# EAGLE design zero_board (EAGLE 6.6.0)
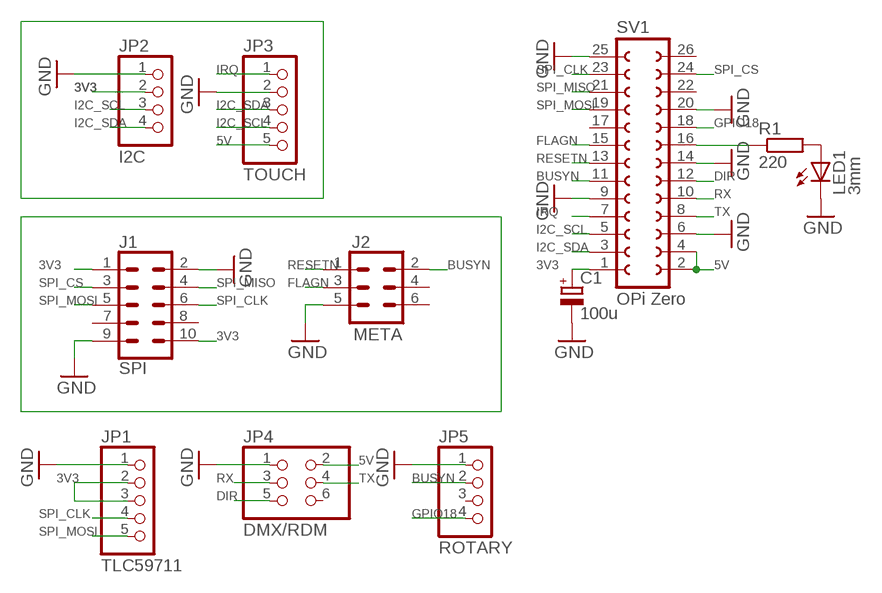
[diagram p0: schematic, sheet 1]

## Parts
C1  100u  CPOL-EUE2.5-6  [E2,5-6]
J1  SPI  CONN_05X2SHD  [2X5-SHROUDED]
J2  META  CONN_03X2SHROUD  [2X3-SHROUDED]
JP1  TLC59711  PINHD-1X5  [1X05]
JP2  I2C  PINHD-1X4  [1X04]
JP3  TOUCH  PINHD-1X5  [1X05]
JP4  DMX/RDM  PINHD-2X3  [2X03]
JP5  ROTARY  PINHD-1X4  [1X04]
LED1  3mm  LED3MM  [LED3MM]
R1  220  R-EU_0204/2V  [0204V]
SV1  OPi Zero  FE13-2  [FE13-2]

## Nets
3V3: C1.+ J1.1 J1.10 JP1.2 JP1.3 JP2.2 SV1.1
5V: JP3.5 JP4.2 SV1.2 SV1.4
BUSYN: J2.2 JP5.2 SV1.11
DIR: JP4.5 SV1.12
FLAGN: J2.3 SV1.15
GND: C1.- J1.2 J1.9 J2.5 JP1.1 JP2.1 JP3.2 JP4.1 JP5.1 LED1.K(C) SV1.6 SV1.9 SV1.14 SV1.20 SV1.25
GPIO18: JP5.4 SV1.18
I2C_SCL: JP2.3 JP3.4 SV1.5
I2C_SDA: JP2.4 JP3.3 SV1.3
IRQ: JP3.1 SV1.7
N$3: LED1.A R1.2
N$4: R1.1 SV1.16
RESETN: J2.1 SV1.13
RX: JP4.3 SV1.10
SPI_CLK: J1.6 JP1.4 SV1.23
SPI_CS: J1.3 SV1.24
SPI_MISO: J1.4 SV1.21
SPI_MOSI: J1.5 JP1.5 SV1.19
TX: JP4.4 SV1.8
Unconnected: J1.7 J1.8 J2.4 J2.6 JP4.6 JP5.3 SV1.17 SV1.22 SV1.26

## Library data of the parts
C1 = rcl:CPOL-EU: POLARIZED CAPACITOR, European symbol
J1 = SparkFun-Connectors:CONN_05X2: Multi connection point. Often used as Generic Header-pin footprint for 0.1 inch spaced/style header connections For AVR SPI programming port, see special device with nice symbol: "AVR_SPI_PROG_5x2.dev" You can populate with any combo of single row headers, but if you'd like an exact match, check these: 2x5 AVR ICSP Male Header <https://www.sparkfun.com/products/778> (PRT-00778) 2x5 Pin Shrouded Header <https://www.sparkfun.com/products/8506> (PRT-08506) On any of the 0.1 inch spaced packages, you can populate with these: Break Away Headers - Straight <https://www.sparkfun.com/products/116> (PRT-00116) Break Away Male Headers - Right Angle <https://www.sparkfun.com/products/553> (PRT-00553) Female Headers <https://www.sparkfun.com/products/115> (PRT-00115) Break Away Headers - Machine Pin <https://www.sparkfun.com/products/117> (PRT-00117) Break Away Female Headers - Swiss Machine Pin <https://www.sparkfun.com/products/743> (PRT-00743) Special note: the shrouded connector mates well with our 5x2 ribbon cables: 2x5 Pin IDC Ribbon Cable <https://www.sparkfun.com/products/8535> (PRT-08535); PROD_ID: CONN-08671; SF_ID: PRT-08506
J2 = SparkFun-Connectors:CONN_03X2: Multi connection point. Often used as Generic Header-pin footprint for 0.1 inch spaced/style header connections You can populate with any combo of single row headers, but if you'd like an exact match, check these: Header - 2x3 (Male, 0.1") <https://www.sparkfun.com/products/12807> (PRT-12807) Header - 2x3 (Female, 0.1") <https://www.sparkfun.com/products/13010> (PRT-13010) 2x3 Pin Shrouded Header <https://www.sparkfun.com/products/10877> (PRT-10877) On any of the 0.1 inch spaced packages, you can populate with these: Break Away Headers - Straight <https://www.sparkfun.com/products/116> (PRT-00116) Break Away Male Headers - Right Angle <https://www.sparkfun.com/products/553> (PRT-00553) Female Headers <https://www.sparkfun.com/products/115> (PRT-00115) Break Away Headers - Machine Pin <https://www.sparkfun.com/products/117> (PRT-00117) Break Away Female Headers - Swiss Machine Pin <https://www.sparkfun.com/products/743> (PRT-00743) Special note: the shrouded connector mates well with our 3x2 ribbon cables: Ribbon Crimp Connector - 6-pin (2x3, Female) <https://www.sparkfun.com/products/10651> (PRT-10651) Ribbon Cable - 6 wire (15ft) <https://www.sparkfun.com/products/10646> (PRT-10646); PROD_ID: CONN-10681; SF_ID: PRT_10877
JP1 JP3 = pinhead:PINHD-1X5: PIN HEADER
JP2 JP5 = pinhead:PINHD-1X4: PIN HEADER
JP4 = pinhead:PINHD-2X3: PIN HEADER
LED1 = led:LED: LED OSRAM: - CHIPLED LG R971, LG N971, LY N971, LG Q971, LY Q971, LO R971, LY R971 LH N974, LH R974 LS Q976, LO Q976, LY Q976 LO Q996 - Hyper CHIPLED LW Q18S LB Q993, LB Q99A, LB R99A - SideLED LS A670, LO A670, LY A670, LG A670, LP A670 LB A673, LV A673, LT A673, LW A673 LH A674 LY A675 LS A676, LA A676, LO A676, LY A676, LW A676 LS A679, LY A679, LG A679 - Hyper Micro SIDELED® LS Y876, LA Y876, LO Y876, LY Y876 LT Y87S - SmartLED LW L88C, LW L88S LB L89C, LB L89S, LG L890 LS L89K, LO L89K, LY L89K LS L896, LA L896, LO L896, LY L896 - TOPLED LS T670, LO T670, LY T670, LG T670, LP T670 LSG T670, LSP T670, LSY T670, LOP T670, LYG T670 LG T671, LOG T671, LSG T671 LB T673, LV T673, LT T673, LW T673 LH T674 LS T676, LA T676, LO T676, LY T676, LB T676, LH T676, LSB T676, LW T676 LB T67C, LV T67C, LT T67C, LS T67K, LO T67K, LY T67K, LW E67C LS E67B, LA E67B, LO E67B, LY E67B, LB E67C, LV E67C, LT E67C LW T67C LS T679, LY T679, LG T679 LS T770, LO T770, LY T770, LG T770, LP T770 LB T773, LV T773, LT T773, LW T773 LH T774 LS E675, LA E675, LY E675, LS T675 LS T776, LA T776, LO T776, LY T776, LB T776 LHGB T686 LT T68C, LB T68C - Hyper Mini TOPLED® LB M676 - Mini TOPLED Santana® LG M470 LS M47K, LO M47K, LY M47K Source: http://www.osram.convergy.de LUXEON: - LUMILED® LXK2-PW12-R00, LXK2-PW12-S00, LXK2-PW14-U00, LXK2-PW14-V00 LXK2-PM12-R00, LXK2-PM12-S00, LXK2-PM14-U00 LXK2-PE12-Q00, LXK2-PE12-R00, LXK2-PE12-S00, LXK2-PE14-T00, LXK2-PE14-U00 LXK2-PB12-K00, LXK2-PB12-L00, LXK2-PB12-M00, LXK2-PB14-N00, LXK2-PB14-P00, LXK2-PB14-Q00 LXK2-PR12-L00, LXK2-PR12-M00, LXK2-PR14-Q00, LXK2-PR14-R00 LXK2-PD12-Q00, LXK2-PD12-R00, LXK2-PD12-S00 LXK2-PH12-R00, LXK2-PH12-S00 LXK2-PL12-P00, LXK2-PL12-Q00, LXK2-PL12-R00 Source: www.luxeon.com KINGBRIGHT: KA-3528ASYC Source: www.kingbright.com
R1 = resistor:R-EU_: RESISTOR, European symbol
SV1 = con-lsta:FE13-2: FEMALE HEADER; OC_FARNELL: unknown; OC_NEWARK: unknown

## Board
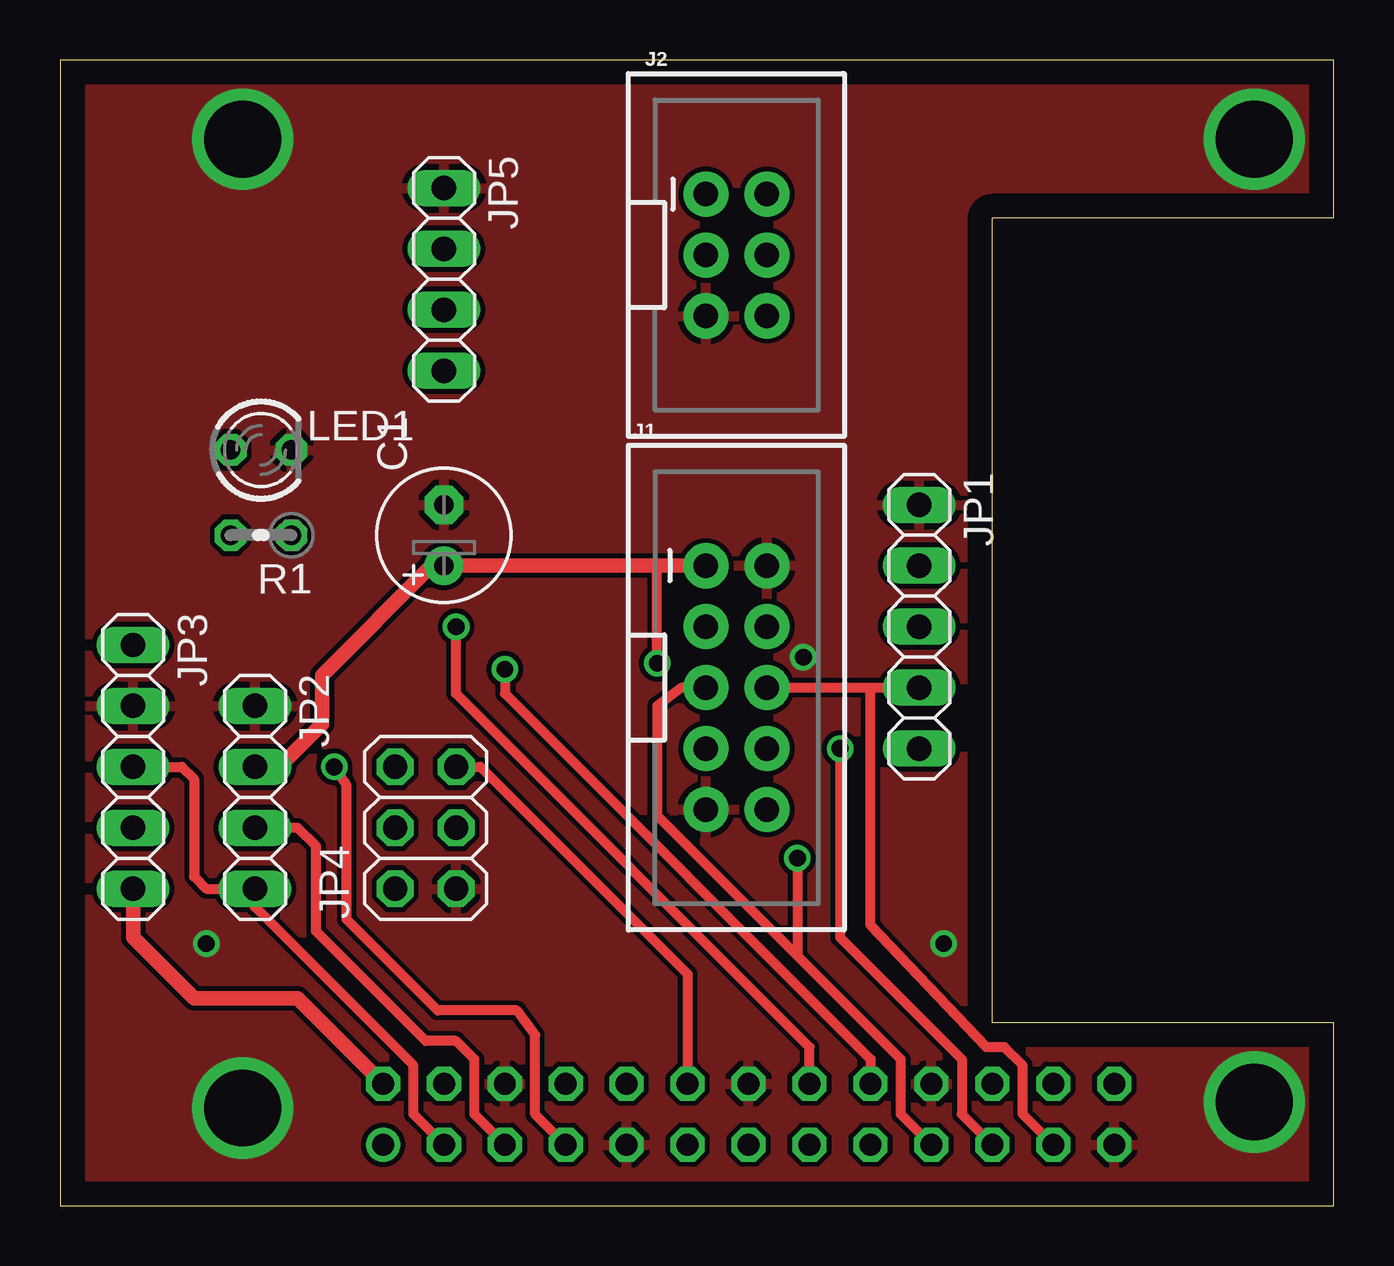
[diagram p1: board, top side]
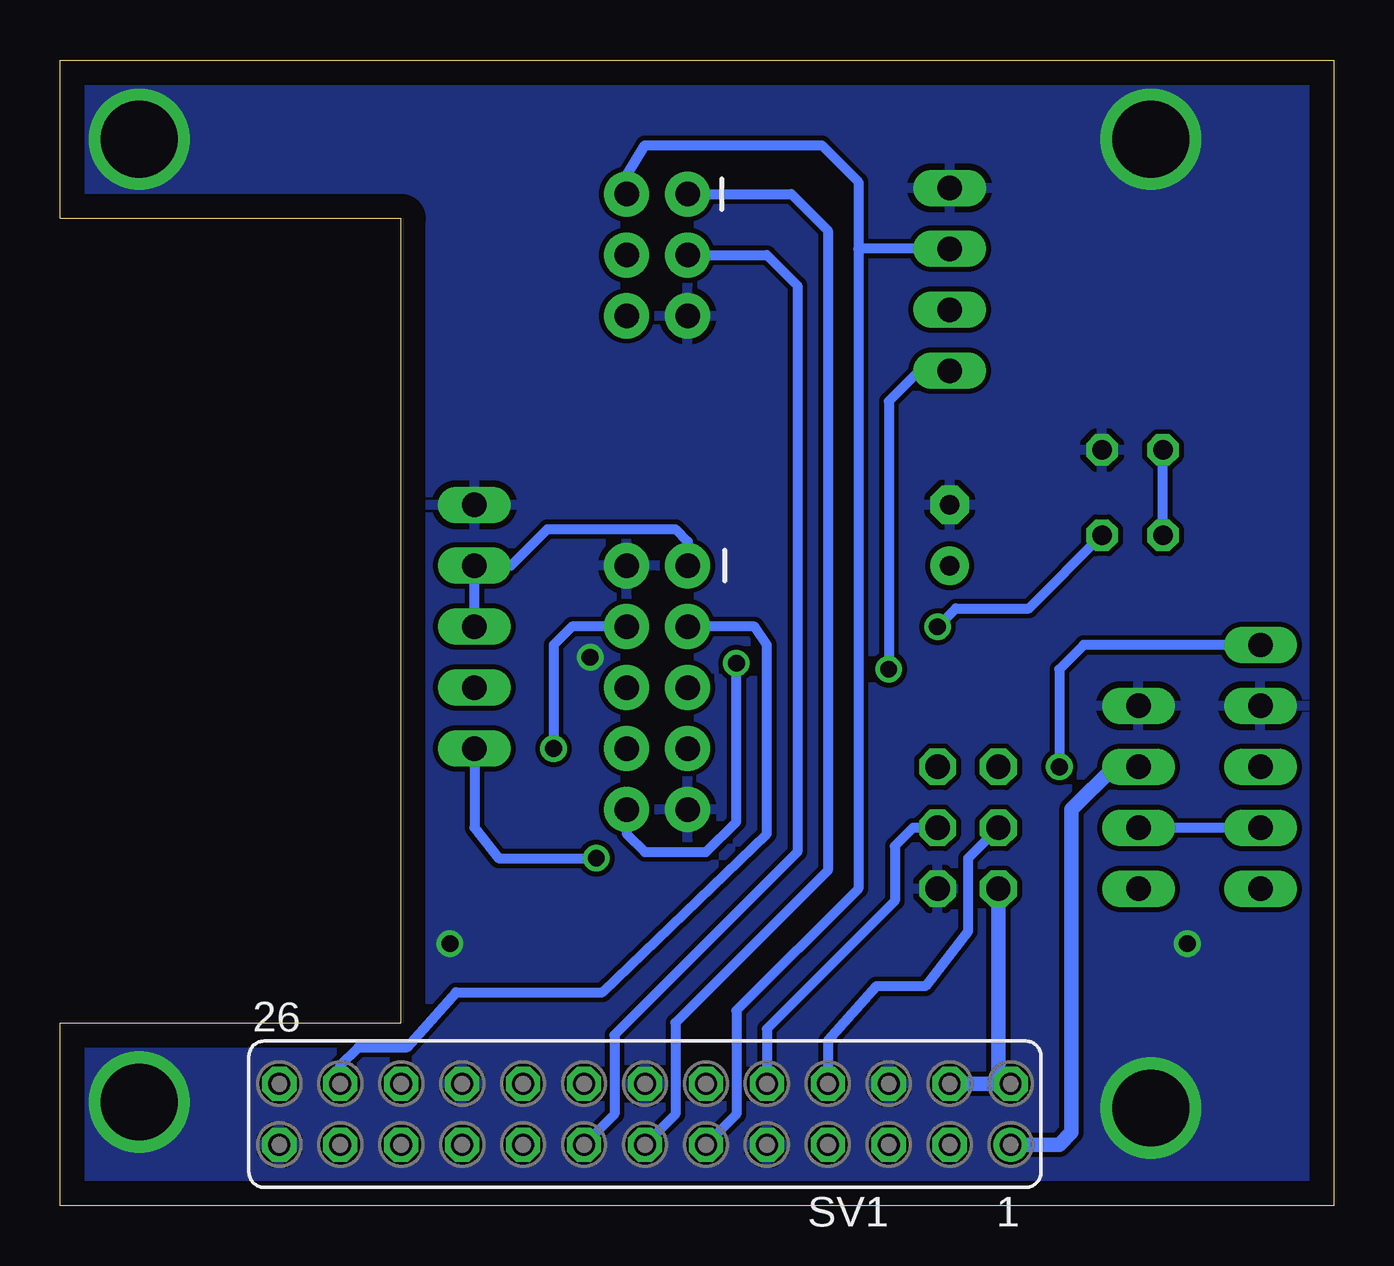
[diagram p2: board, bottom side, seen from below]

Size 53.09 x 47.75 mm. Coordinates in mm from the lower left corner, seen from the top.
Outline: 0,0 53.09,0 53.09,7.62 38.86,7.62 38.86,41.15 53.09,41.15 53.09,47.75 0,47.75 0,0
Copper layers (1*16): Top 0.035mm / dielectric 1.5mm / Bottom 0.035mm
Design rules "default": minimum track width 10mil, minimum drill 24mil, track to track 8mil, track to pad 8mil, pad to pad 8mil, via to via 8mil, smd to smd 8mil, copper to edge 40mil, drill to drill 8mil, minimum pad ring 10mil, minimum via ring 8mil, stop-mask expansion 4mil, vias tented up to drill 0mil, thermal gap 10mil

### Footprints (pad centres in the part's own frame; a part is rotated, then mirrored left to right if it is on the bottom)
E2,5-6 = drill 0.813 pad 1.6: + -1.27,0 | drill 0.813 pad 1.6 octagon: - 1.27,0
2X5-SHROUDED = drill 1.016 pad 1.88: 1 -1.27,5.08; 2 1.27,5.08; 3 -1.27,2.54; 4 1.27,2.54; 5 -1.27,0; 6 1.27,0; 7 -1.27,-2.54; 8 1.27,-2.54; 9 -1.27,-5.08; 10 1.27,-5.08
2X3-SHROUDED = drill 1.016 pad 1.88: 1 -1.27,2.54; 2 1.27,2.54; 3 -1.27,0; 4 1.27,0; 5 -1.27,-2.54; 6 1.27,-2.54
1X05 = drill 1.016 long: 1 -5.08,0; 2 -2.54,0; 3 0,0; 4 2.54,0; 5 5.08,0
1X04 = drill 1.016 long: 1 -3.81,0; 2 -1.27,0; 3 1.27,0; 4 3.81,0
2X03 = drill 1.016 octagon: 1 -2.54,-1.27; 2 -2.54,1.27; 3 0,-1.27; 4 0,1.27; 5 2.54,-1.27; 6 2.54,1.27
LED3MM = drill 0.813 octagon: A -1.27,0; K 1.27,0
0204V = drill 0.813 octagon: 1 -1.27,0; 2 1.27,0
FE13-2 = drill 0.914: 1 -15.24,1.27 | drill 0.914 octagon: 2 -15.24,-1.27; 3 -12.7,1.27; 4 -12.7,-1.27; 5 -10.16,1.27; 6 -10.16,-1.27; 7 -7.62,1.27; 8 -7.62,-1.27; 9 -5.08,1.27; 10 -5.08,-1.27; 11 -2.54,1.27; 12 -2.54,-1.27; 13 0,1.27; 14 0,-1.27; 15 2.54,1.27; 16 2.54,-1.27; 17 5.08,1.27; 18 5.08,-1.27; 19 7.62,1.27; 20 7.62,-1.27; 21 10.16,1.27; 22 10.16,-1.27; 23 12.7,1.27; 24 12.7,-1.27; 25 15.24,1.27; 26 15.24,-1.27

### Placement (x,y rotation side)
C1  16,27.94 90 top
J1  28.19,21.59 0 top
J2  28.19,39.62 0 top
JP1  35.81,24.13 270 top
JP2  8.13,17.02 270 top
JP3  3.05,18.29 270 top
JP4  15.24,15.75 90 top
JP5  16,38.61 270 top
LED1  8.38,31.5 0 top
R1  8.38,27.94 180 top
SV1  28.7,3.81 180 bottom

### Tracks (layer width: path | path; a pad name or v marks a point on that pad's centre or on a via)
3V3  (via drill 0.7)
  Top 0.406: v24.89,22.61 24.89,26.67
  Top 0.61: J1.1 24.89,26.67 C1.+ 15.49,26.67 10.92,22.1 10.92,20.07 9.14,18.29 JP2.2
  Bottom 0.406: JP2.2 9.14,18.29 | J1.10 29.46,15.49 28.7,14.73 26.16,14.73 24.89,16 v24.89,22.61 | JP1.3 JP1.2 34.29,26.67 32.77,28.19 27.43,28.19 26.92,27.69 J1.1
  Bottom 0.61: 9.14,18.29 10.92,16.51 10.92,3.05 11.43,2.54 SV1.1
5V
  Top 0.61: SV1.2 9.91,8.64 5.59,8.64 3.05,11.18 JP3.5
  Bottom 0.61: SV1.2 13.97,5.08 | 13.97,5.08 SV1.4 | JP4.2 13.97,5.08
BUSYN
  Bottom 0.406: J2.2 29.46,42.93 28.7,44.2 21.34,44.2 19.81,42.67 19.81,39.88 | 19.81,39.88 19.81,13.21 24.89,8.13 24.89,3.81 SV1.11 | JP5.2 19.81,39.88
DIR
  Top 0.406: SV1.12 26.16,9.65 17.53,18.29 JP4.5
FLAGN
  Bottom 0.406: J2.3 23.62,39.62 22.35,38.35 22.35,14.73 29.97,7.11 29.97,3.81 SV1.15
GND  (via drill 0.7, 3.2)
  other vias: 7.62,4.06 49.78,4.32 7.62,44.45 49.78,44.45 30.99,22.86 36.83,10.92 6.1,10.92
  pour Top: -0.25,0 53.59,-0.51 53.59,7.87 39.37,7.87 39.37,41.15 53.34,41.4 53.34,48.51 -0.25,48.26
  pour Bottom: 0,-0.25 52.58,0 52.83,7.87 39.37,7.87 39.37,41.15 53.34,41.15 53.34,48.01 -0.25,47.75
GPIO18  (via drill 0.7)
  Top 0.406: v18.54,22.35 18.54,21.34 33.78,6.1 SV1.18
  Bottom 0.406: JP5.4 17.27,34.8 18.54,33.53 v18.54,22.35
I2C_SCL
  Top 0.406: SV1.5 17.27,3.81 17.27,6.1 16.51,6.86 15.24,6.86 10.67,11.43 10.67,14.99 9.91,15.75 JP2.3
  Bottom 0.406: JP3.4 JP2.3
I2C_SDA
  Top 0.406: SV1.3 14.73,3.81 14.73,5.84 8.13,12.45 JP2.4 6.1,13.21 5.59,13.72 5.59,17.78 5.08,18.29 JP3.3
IRQ  (via drill 0.7)
  Top 0.406: SV1.7 19.81,3.81 19.81,7.11 19.05,8.13 15.75,8.13 11.94,11.94 11.94,17.53 v11.43,18.29
  Bottom 0.406: JP3.1 10.41,23.37 11.43,22.35 v11.43,18.29
N$3
  Bottom 0.406: R1.2 LED1.A
N$4  (via drill 0.7)
  Top 0.406: SV1.16 31.24,6.6 16.51,21.34 v16.51,24.13
  Bottom 0.406: v16.51,24.13 15.75,24.89 12.7,24.89 R1.1
RESETN
  Bottom 0.406: J2.1 22.61,42.16 21.08,40.64 21.08,13.97 27.43,7.62 27.43,3.81 SV1.13
RX
  Bottom 0.406: JP4.3 17.53,15.75 18.29,14.99 18.29,12.7 23.62,7.37 SV1.10
SPI_CLK
  Top 0.406: SV1.23 40.13,3.81 40.13,5.84 39.37,6.6 38.61,6.6 33.78,11.68 33.78,21.59 | J1.6 33.78,21.59 | 33.78,21.59 JP1.4
SPI_CS
  Bottom 0.406: SV1.24 41.4,5.84 40.64,6.6 38.61,6.6 36.58,8.89 30.48,8.89 23.62,15.49 23.62,23.37 24.13,24.13 J1.3
SPI_MISO  (via drill 0.7)
  Top 0.406: v32.51,19.05 32.51,11.18 37.59,6.1 37.59,3.81 SV1.21
  Bottom 0.406: J1.4 31.75,24.13 32.51,23.37 v32.51,19.05
SPI_MOSI  (via drill 0.7)
  Top 0.406: J1.5 25.91,21.59 24.89,20.83 24.89,16.26 30.73,10.41 | SV1.19 35.05,3.81 35.05,6.1 30.73,10.41 | v30.73,14.48 30.73,10.41
  Bottom 0.406: JP1.5 35.81,15.75 34.8,14.48 v30.73,14.48
TX
  Bottom 0.406: JP4.4 15.24,14.48 15.24,11.43 17.02,9.14 19.05,9.14 21.08,6.86 SV1.8